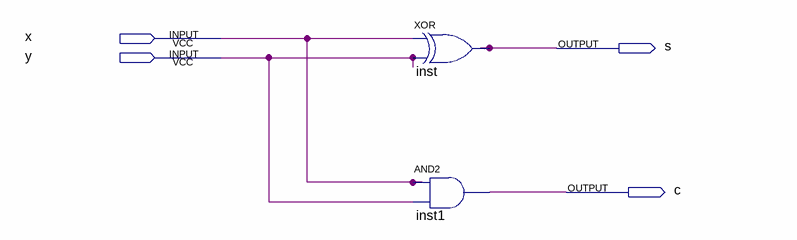
[diagram p0: schematic sheet]
// Quartus schematic half_adder_bdf.bdf as structural Verilog: 2 symbols, 4 pins
module half_adder_bdf (
  input  x,
  input  y,
  output s,
  output c
);

  xor inst (s, x, y);
  and inst1 (c, x, y);
endmodule
